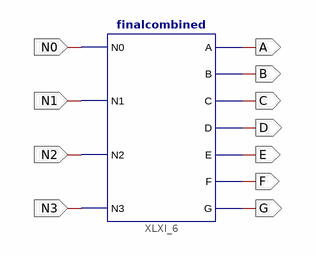
[diagram p0: schematic sheet 1]
// Xilinx ISE schematic finalfinal.sch (spartan3e) as structural Verilog: 1 symbols, 11 ports
module finalfinal (
  input  N0,
  input  N1,
  input  N2,
  input  N3,
  output A,
  output B,
  output C,
  output D,
  output E,
  output F,
  output G
);

  finalcombined XLXI_6 (.N0(N0), .N1(N1), .N2(N2), .N3(N3), .A(A), .B(B), .C(C), .D(D), .E(E), .F(F), .G(G));
endmodule
